# Altium schematic sheet Connection.SchDoc
size A4; SheetNumber: 4; SheetTotal: 4
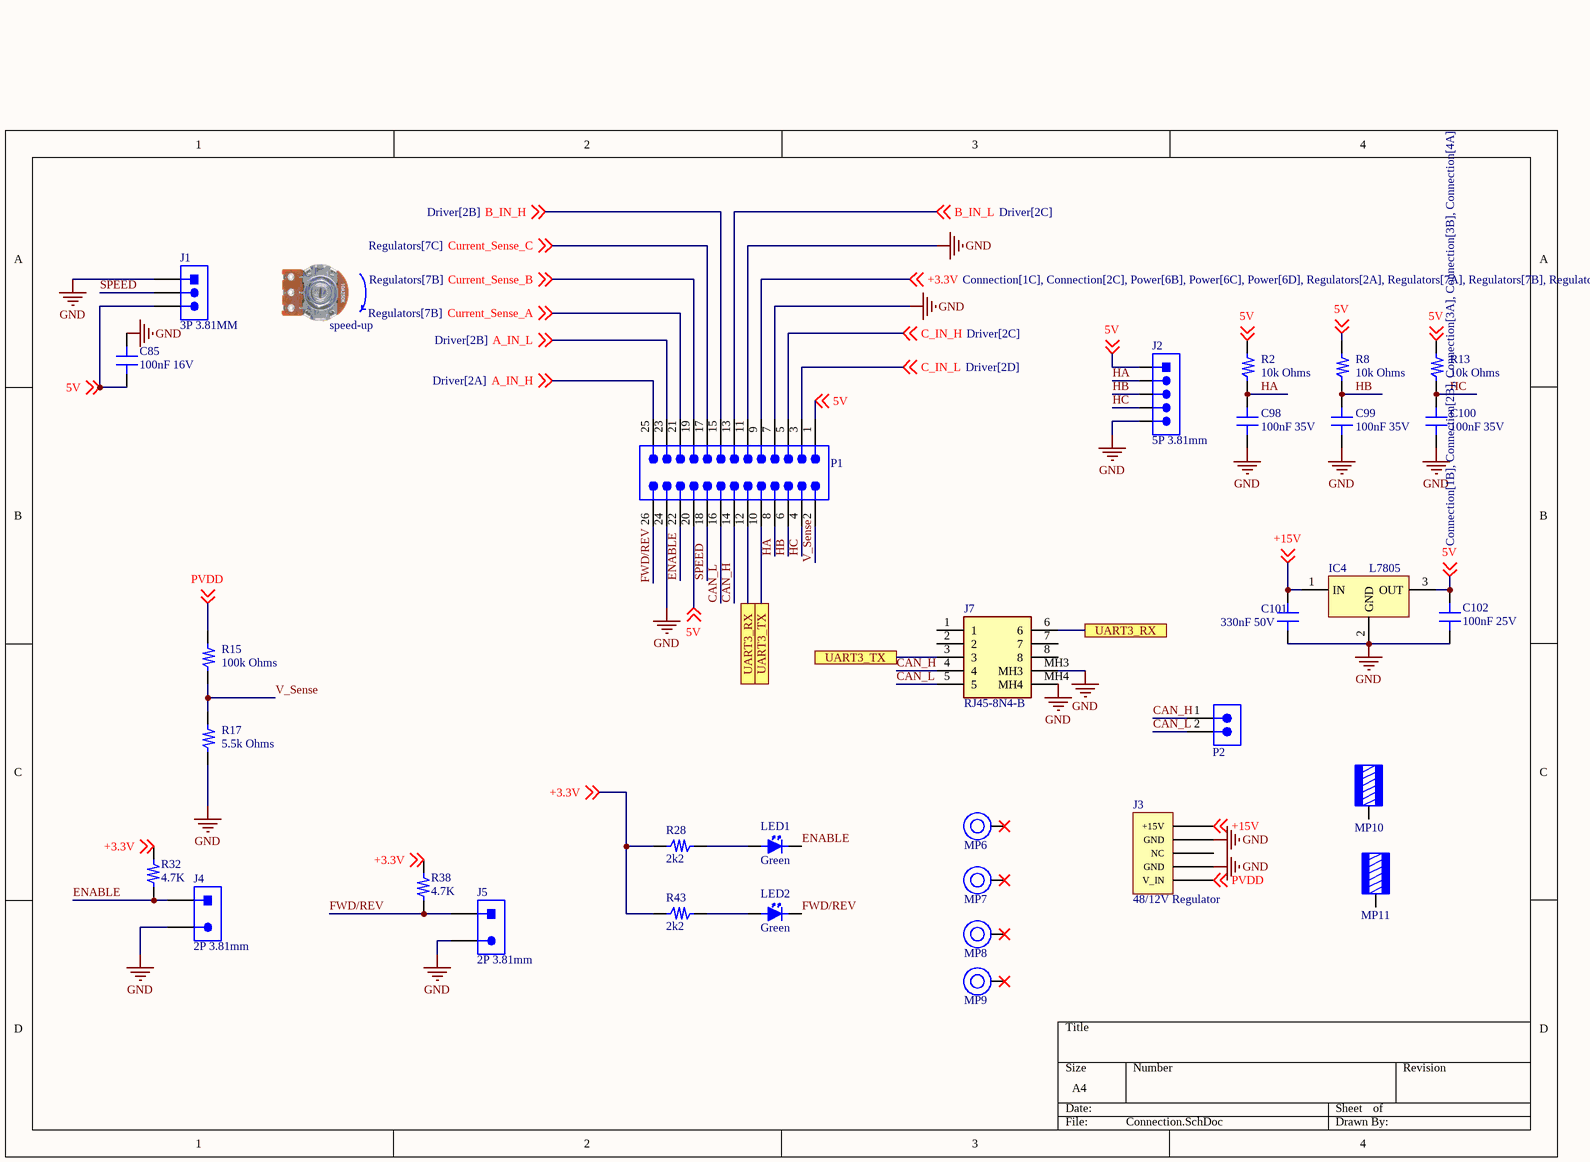
[diagram p0: Connection.SchDoc]

## Parts
C85  100nF 16V  [0805_CAP]
C98  100nF 35V  [0805_CAP]
C99  100nF 35V  [0805_CAP]
C100  100nF 35V  [0805_CAP]
C101  330nF 50V  [0805_CAP]
C102  100nF 25V  [0805_CAP]
IC4  L7805  [TO-220-3]
J1  3P 3.81MM  [TB3_3.81_90C]
J2  5P 3.81mm  [TB5 3.81MM]
J3  48/12V Regulator  [48/12V REGULATOR]
J4  2P 3.81mm  [TB2_3.81MM]
J5  2P 3.81mm  [TB2_3.81MM]
J7  RJ45-8N4-B  [RJ458N4B]
LED1  Green  [0805LED]
LED2  Green  [0805LED]
MP6  M3 x 11mm  [9774110360]  (value not drawn)
MP7  M3 x 11mm  [9774110360]  (value not drawn)
MP8  M3 x 11mm  [9774110360]  (value not drawn)
MP9  M3 x 11mm  [9774110360]  (value not drawn)
MP10  M3  [7466303]  (value not drawn)
MP11  M3  [7466303]  (value not drawn)
P1  61302621121  [61302621121]  (value not drawn)
P2  61300211121  [61300211121]  (value not drawn)
R2  10k Ohms  [0805_RES]
R8  10k Ohms  [0805_RES]
R13  10k Ohms  [0805_RES]
R15  100k Ohms  [0805_RES]
R17  5.5k Ohms  [0805_RES]
R28  2k2  [0603_RES]
R32  4.7K  [0603_RES]
R38  4.7K  [0603_RES]
R43  2k2  [0603_RES]

## Ports
UART3_RX (see Connection[2C]), UART3_RX (see Connection[3B]), UART3_TX (see Connection[2C]), UART3_TX (see Connection[3C])

## Nets
GND: C85.1 C98.1 C99.1 C100.1 C101.1 C102.1 IC4.2(GND) J1.1 J2.5 J3.2(GND) J3.4(GND) J4.2 J5.2 J7.MH3 J7.MH4 P1.7 P1.11 P1.24 R17.2
5V: C85.2 C102.2 IC4.3(OUT) J1.3 J2.1 P1.1 P1.20 R2.1 R8.1 R13.1 ; off-sheet 5V
+3.3V: P1.9 R28.1 R32.2 R38.2 R43.1 ; off-sheet +3.3V
+15V: C101.2 IC4.1(IN) J3.1(+15V) ; off-sheet +15V
A_IN_H: P1.25 ; off-sheet A_IN_H
A_IN_L: P1.23 ; off-sheet A_IN_L
B_IN_H: P1.15 ; off-sheet B_IN_H
B_IN_L: P1.13 ; off-sheet B_IN_L
C_IN_H: P1.5 ; off-sheet C_IN_H
C_IN_L: P1.3 ; off-sheet C_IN_L
CAN_H: J7.4 P1.14 P2.1
CAN_L: J7.5 P1.16 P2.2
Current_Sense_A: P1.21 ; off-sheet Current_Sense_A
Current_Sense_B: P1.19 ; off-sheet Current_Sense_B
Current_Sense_C: P1.17 ; off-sheet Current_Sense_C
ENABLE: J4.1 LED1.2(Cathode(-)) P1.22 R32.1
FWD/REV: J5.1 LED2.2(Cathode(-)) P1.26 R38.1
HA: C98.2 J2.2 P1.8 R2.2
HB: C99.2 J2.3 P1.6 R8.2
HC: C100.2 J2.4 P1.4 R13.2
PVDD: J3.5(V_IN) R15.1 ; off-sheet PVDD
SPEED: J1.2 P1.18
UART3_RX: J7.6 P1.12 ; port UART3_RX
UART3_TX: J7.3 P1.10 ; port UART3_TX
V_Sense: P1.2 R15.2 R17.1
NetLED1_1: LED1.1(Anode(+)) R28.2
NetLED2_1: LED2.1(Anode(+)) R43.2

Not connected (* = marked no-connect by the designer): J3 3(NC); J7 1 2 7 8; MP6 1*; MP7 1*; MP8 1*; MP9 1*; MP10 1; MP11 1

## Notes on the sheet
- speed-up

## Library data of the parts
C85 C98-C102 = CAP_0805
  C85: Value: 100nF 16V
  C98-C100: Value: 100nF 35V
  C101: Value: 330nF 50V
  C102: Value: 100nF 25V
IC4 = L7806: L7806CV-DG - IC-7806 V.REG.+5V 1.5A TO220 DOUBLE GAUGE ST; ComponentLink1Description: Özdisan; ComponentLink1URL: https://ozdisan.com/entegre-devreler-ics/guc-entegreleri/lineer-voltaj-regulatorleri/L7806CV-DG/5861; PartValue: L7805; ComponentLink2Description: Datasheet; ComponentLink2URL: https://cdn.ozdisan.com/ETicaret_Dosya/39226_7065362.pdf
J1 = TBLOCK3 3.81MM: 15EDGRC-3.81-03P-11-00AH - TERM.BLK.3.81MM 3P 90C MALE GRAY CLOSED; ComponentLink1Description: Özdisan; ComponentLink1URL: https://www.ozdisan.com/Product/Detail/515263/15EDGRC-3-81-03P-11-00AH; ComponentLink2Description: Datasheet; ComponentLink2URL: https://enoss.degson.com/upload/file/20210313/10030000179/15EDGRC-3.81-XXP-1Y-00A(H)T0-1.pdf
J2 = TBLOCK5 3.81MM: 15EDGRC-3.81-05P-14-00AH - TERM.BLK.3.81MM 5P 90C MALE GREEN CLOSED; ComponentLink1Description: Özdisan; ComponentLink1URL: https://www.ozdisan.com/konnektor-ve-baglanti-elemanlari/klemensler/gecmeli-klemensler/15EDGRC-3-81-05P-14-00AH; ComponentLink2Description: Datasheet; ComponentLink2URL: https://enoss.degson.com/upload/file/20210313/10030000179/15EDGRC-3.81-XXP-1Y-00A(H)T0-1.pdf
J3 = 48-12V REGULATOR
J4 J5 = TBLOCK2 3.81MM: 15EDGRC-3.81-02P-11-00AH - TERM.BLK.3.81MM 2P 90C MALE GRAY CLOSED; ComponentLink1Description: Özdisan; ComponentLink1URL: https://ozdisan.com/konnektor-ve-baglanti-elemanlari/klemensler/gecmeli-klemensler/15EDGRC-3-81-02P-11-00AH
J7 = RJ45-8N4-B: Modular Connectors / Ethernet Connectors 6 TRMN BRD/CBLE GRND 8 PIN BLOCK INDUCTOR; Manufacturer_Name: TE Connectivity; Geometry.Height: 13.58mm; Manufacturer_Part_Number: RJ45-8N4-B; Mouser Part Number: 592-RJ45-8N4-B; Mouser Price/Stock: https://www.mouser.co.uk/ProductDetail/TE-Connectivity-PB/RJ45-8N4-B?qs=LiYTmuET8LTUh2dcTsii4g%3D%3D; Arrow Part Number: *; Arrow Price/Stock: *; Datasheet Link: https://www.te.com/commerce/DocumentDelivery/DDEController?Action=showdoc&DocId=Catalog+Section%7F1654001_CORCOM_PRODUCT_GUIDE%7F0611%7Fpdf%7FEnglish%7FENG_CS_1654001_CORCOM_PRODUCT_GUIDE_0611.pdf%7F1-6609212-5
LED1 LED2 = LED: 0805
MP6-MP9 = 9774110360R: WA-SMSI SMT Steel Spacer with internal Thread, OD 6mm, M3 x 11mm; Manufacturer: Wurth Elektronik; Inside Diameter: 4.2mm; Surface: Tin; ComponentLink1Description: Website Link; ComponentLink1URL: https://www.we-online.com/redexpert/article/9774110360R?ad; ComponentLink2Description: Datasheet Link; ComponentLink2URL: https://www.we-online.com/redexpert/spec/9774110360R?ad; Manufacturer Part Number: 9774110360R; Category: SMT Spacers; Match Code: WA-SMSI; Mount: Surface Mount; Operating Temperature Max: 150°C; Operating Temperature Min: -55°C; Packaging: Tape and Reel; Height: 11mm; Material: Steel; Outside Diameter: 6mm; Thread Size: M3
MP10 MP11 = 7466303: WP-SMRA REDCUBE SMT Right Angled without pins, M3, 50A; Manufacturer: Wurth Elektronik; Surface: Tin; ComponentLink1Description: Website Link; ComponentLink1URL: https://www.we-online.com/redexpert/article/7466303?ad; ComponentLink2Description: Datasheet Link; ComponentLink2URL: https://www.we-online.com/redexpert/spec/7466303?ad; Manufacturer Part Number: 7466303; Category: REDCUBE SMT; Match Code: WP-SMRA; Mount: Surface Mount; Operating Temperature Max: 150°C; Operating Temperature Min: -55°C; Packaging: Bulk; Height: 5mm; Material: Brass; Rated Current: 50A; Thread Size: M3
P1 = 61302621121: WR-PHD Pin Header, THT, Vertical, pitch 2.54mm, 2 Row, 26P; Manufacturer: Wurth Elektronik; Contact Resistance: 20mΩ; Rated Current: 3A; Working Voltage: 250V; Withstanding Voltage: 500V; ComponentLink1Description: Website Link; ComponentLink1URL: https://www.we-online.com/redexpert/article/61302621121?ad; ComponentLink2Description: Datasheet Link; ComponentLink2URL: https://www.we-online.com/redexpert/spec/61302621121?ad; Manufacturer Part Number: 61302621121; Category: Board-to-Board Connectors; Match Code: WR-PHD; Mount: Through Hole; Operating Temperature Max: 105°C; Operating Temperature Min: -40°C; Packaging: Bag; Gender: Pin Header; Number of Pins: 26; Number of Rows: 2; Orientation: Vertical; Pitch: 2.54mm
P2 = 61300211121: WR-PHD Pin Header, THT, Vertical, pitch 2.54mm, 1 Row, 2P; Manufacturer: Wurth Elektronik; Contact Resistance: 20mOhm; Rated Current: 3A; Working Voltage: 250V; Withstanding Voltage: 500V; Manufacturer Part Number: 61300211121; Category: Board-to-Board Connectors; Match Code: WR-PHD; ComponentLink1Description: Website Link; ComponentLink1URL: https://www.we-online.com/redexpert/article/61300211121?ad; ComponentLink2Description: Datasheet Link; ComponentLink2URL: https://www.we-online.com/redexpert/spec/61300211121?ad; Mount: Through Hole; Operating Temperature Max: 105°C; Operating Temperature Min: -40°C; Packaging: Bag; Gender: Pin Header; Number of Pins: 2; Number of Rows: 1; Orientation: Vertical; Pitch: 2.54mm
R2 R8 R13 R15 R17 = RES_0805: 0805; Power: 1/8 W
  R2 R8 R13: Value: 10k Ohms
  R15: Value: 100k Ohms
  R17: Value: 5.5k Ohms
R28 R32 R38 R43 = RES_0603: 0603; Value: 0/10 Ohms; Power: 1/8W